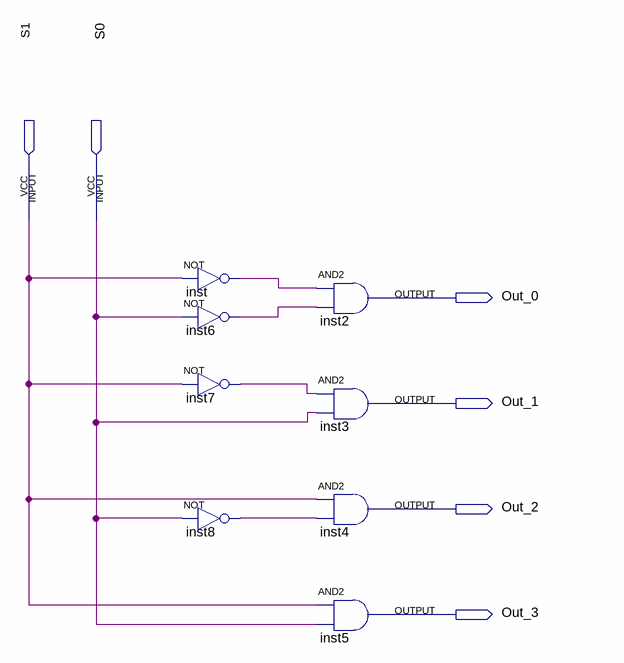
[diagram p0: schematic sheet]
// Quartus schematic Seletor4Canais.bdf as structural Verilog: 8 symbols, 6 pins
module Seletor4Canais (
  input  S1,
  input  S0,
  output Out_0,
  output Out_1,
  output Out_2,
  output Out_3
);

  wire inst6_out, inst7_out, inst8_out, inst_out;

  not inst (inst_out, S1);
  not inst6 (inst6_out, S0);
  not inst7 (inst7_out, S1);
  not inst8 (inst8_out, S0);
  and inst2 (Out_0, inst_out, inst6_out);
  and inst3 (Out_1, inst7_out, S0);
  and inst4 (Out_2, S1, inst8_out);
  and inst5 (Out_3, S1, S0);
endmodule
